# Altium schematic sheet rf_txmix.SchDoc: mcHF QRP Transceiver RF board
size A4; Author: K Atanassov; CompanyName: M0NKA; Revision: 0.6.3; SheetTotal: 12
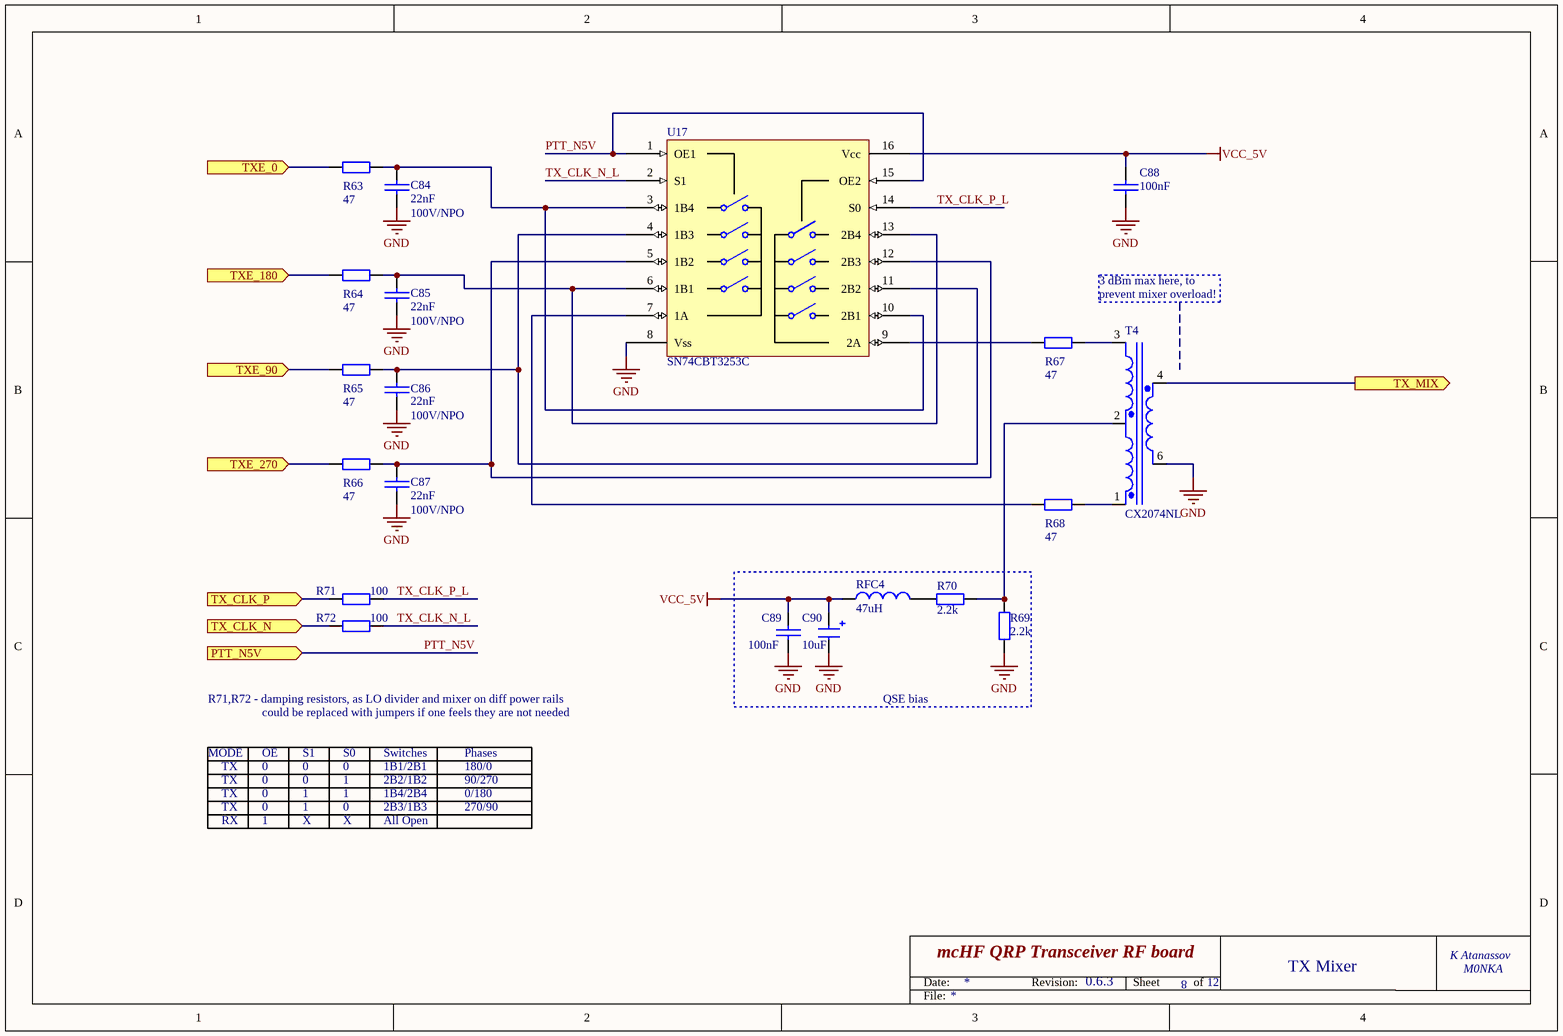
[diagram p0: rf_txmix.SchDoc]

## Parts
C84  22nF  Voltage: 100V/NPO  [CAP_B]
C85  22nF  Voltage: 100V/NPO  [CAP_B]
C86  22nF  Voltage: 100V/NPO  [CAP_B]
C87  22nF  Voltage: 100V/NPO  [CAP_B]
C88  100nF  [0805-Pro]
C89  100nF  [0805-Pro]
C90  10uF  [1206_Elec_Cap_N]
R63  47  [0805-Pro]
R64  47  [0805-Pro]
R65  47  [0805-Pro]
R66  47  [0805-Pro]
R67  47  [0805-Pro]
R68  47  [0805-Pro]
R69  2.2k  [0805-Pro]
R70  2.2k  [0805-Pro]
R71  100  [0805-Pro]
R72  100  [0805-Pro]
RFC4  47uH  [0805-Pro]
T4  CX2074NL  [SOP5_NEW1]
U17  SN74CBT3253C  [SO-16-Pro]

## Blocks framed on the sheet
QSE bias: C89 C90 R69 R70 RFC4

## Ports
PTT_N5V (in), TX_CLK_N (in), TX_CLK_P (in), TX_MIX (out), TXE_0 (in), TXE_90 (in), TXE_180 (in), TXE_270 (in)

## Nets
GND: C84.2 C85.2 C86.2 C87.2 C88.1 C89.1 C90.2 R69.1 T4.6(Pri+) U17.8(Vss)
VCC_5V: C88.2 C89.2 C90.1 RFC4.1 U17.16(Vcc)
PTT_N5V: U17.1(OE1) U17.15(OE2) ; port PTT_N5V
TX_CLK_N: R72.2 ; port TX_CLK_N
TX_CLK_N_L: R72.1 U17.2(S1)
TX_CLK_P: R71.2 ; port TX_CLK_P
TX_CLK_P_L: R71.1 U17.14(S0)
TX_MIX: T4.4(Pri-) ; port TX_MIX
TXE_0: R63.1 ; port TXE_0
TXE_90: R65.1 ; port TXE_90
TXE_180: R64.1 ; port TXE_180
TXE_270: R66.1 ; port TXE_270
NetC84_1: C84.1 R63.2 U17.3(1B4) U17.10(2B1)
NetC85_1: C85.1 R64.2 U17.6(1B1) U17.13(2B4)
NetC86_1: C86.1 R65.2 U17.4(1B3) U17.11(2B2)
NetC87_1: C87.1 R66.2 U17.5(1B2) U17.12(2B3)
NetR67_1: R67.1 U17.9(2A)
NetR67_2: R67.2 T4.3(Sec180)
NetR68_1: R68.1 U17.7(1A)
NetR68_2: R68.2 T4.1(Sec0)
NetR69_2: R69.2 R70.1 T4.2(SecCmn)
NetR70_2: R70.2 RFC4.2

## Notes on the sheet
- 3 dBm max here, to
- prevent mixer overload!
- R71,R72 - damping resistors, as LO divider and mixer on diff power rails
- could be replaced with jumpers if one feels they are not needed
- MODE
- TX
- 0
- OE
- S1
- S0
- 1
- Switches
- 1B1/2B1
- 2B2/1B2
- Phases
- 180/0
- 90/270
- RX
- X
- 2B3/1B3
- 1B4/2B4
- All Open
- 270/90
- 0/180
- 8
- TX Mixer
- Date:
- Revision:
- Sheet
- of
- File:

## Library data of the parts
C84-C87 = CAP: Capacitor; Order: FN 221-1120; Price: 0.84
C88 C89 = CAP: Capacitor; Order: FN 252-2090; QT Order: QCC-00154; Price: 0.068
C90 = CAP-POL: Electrolitic capacitor; Order: FN 233-3009; QT Order: QCC-00166; Price: 0.204
R63-R68 = RES: Resistor; Order: FN 173-8942; QT Order: QCR-00293; Price: 0.052
R69 R70 = RES: Resistor; Order: FN 188-7289; QT Order: QCR-00333; Price: 0.046
R71 R72 = RES: Resistor; Order: FN 933-2375; QT Order: QCR-00301; Price: 0.027
RFC4 = TDK-NLV25T: INDUCTOR, SIGNAL LINE, 4.7UH, 1005; Order: FN 166-9895; Price: 0.166
T4 = CX2074NL: Wideband RF Transformer 1:4; Order: DK 553-1655-ND; Price: 2.01
U17 = SN74CBT3253C: Dual 4:1 Demux/Analog Switch; Order: FN 175-0447; Price: 0.69